# EAGLE schematic 19P_Connector (EAGLE 6.3)
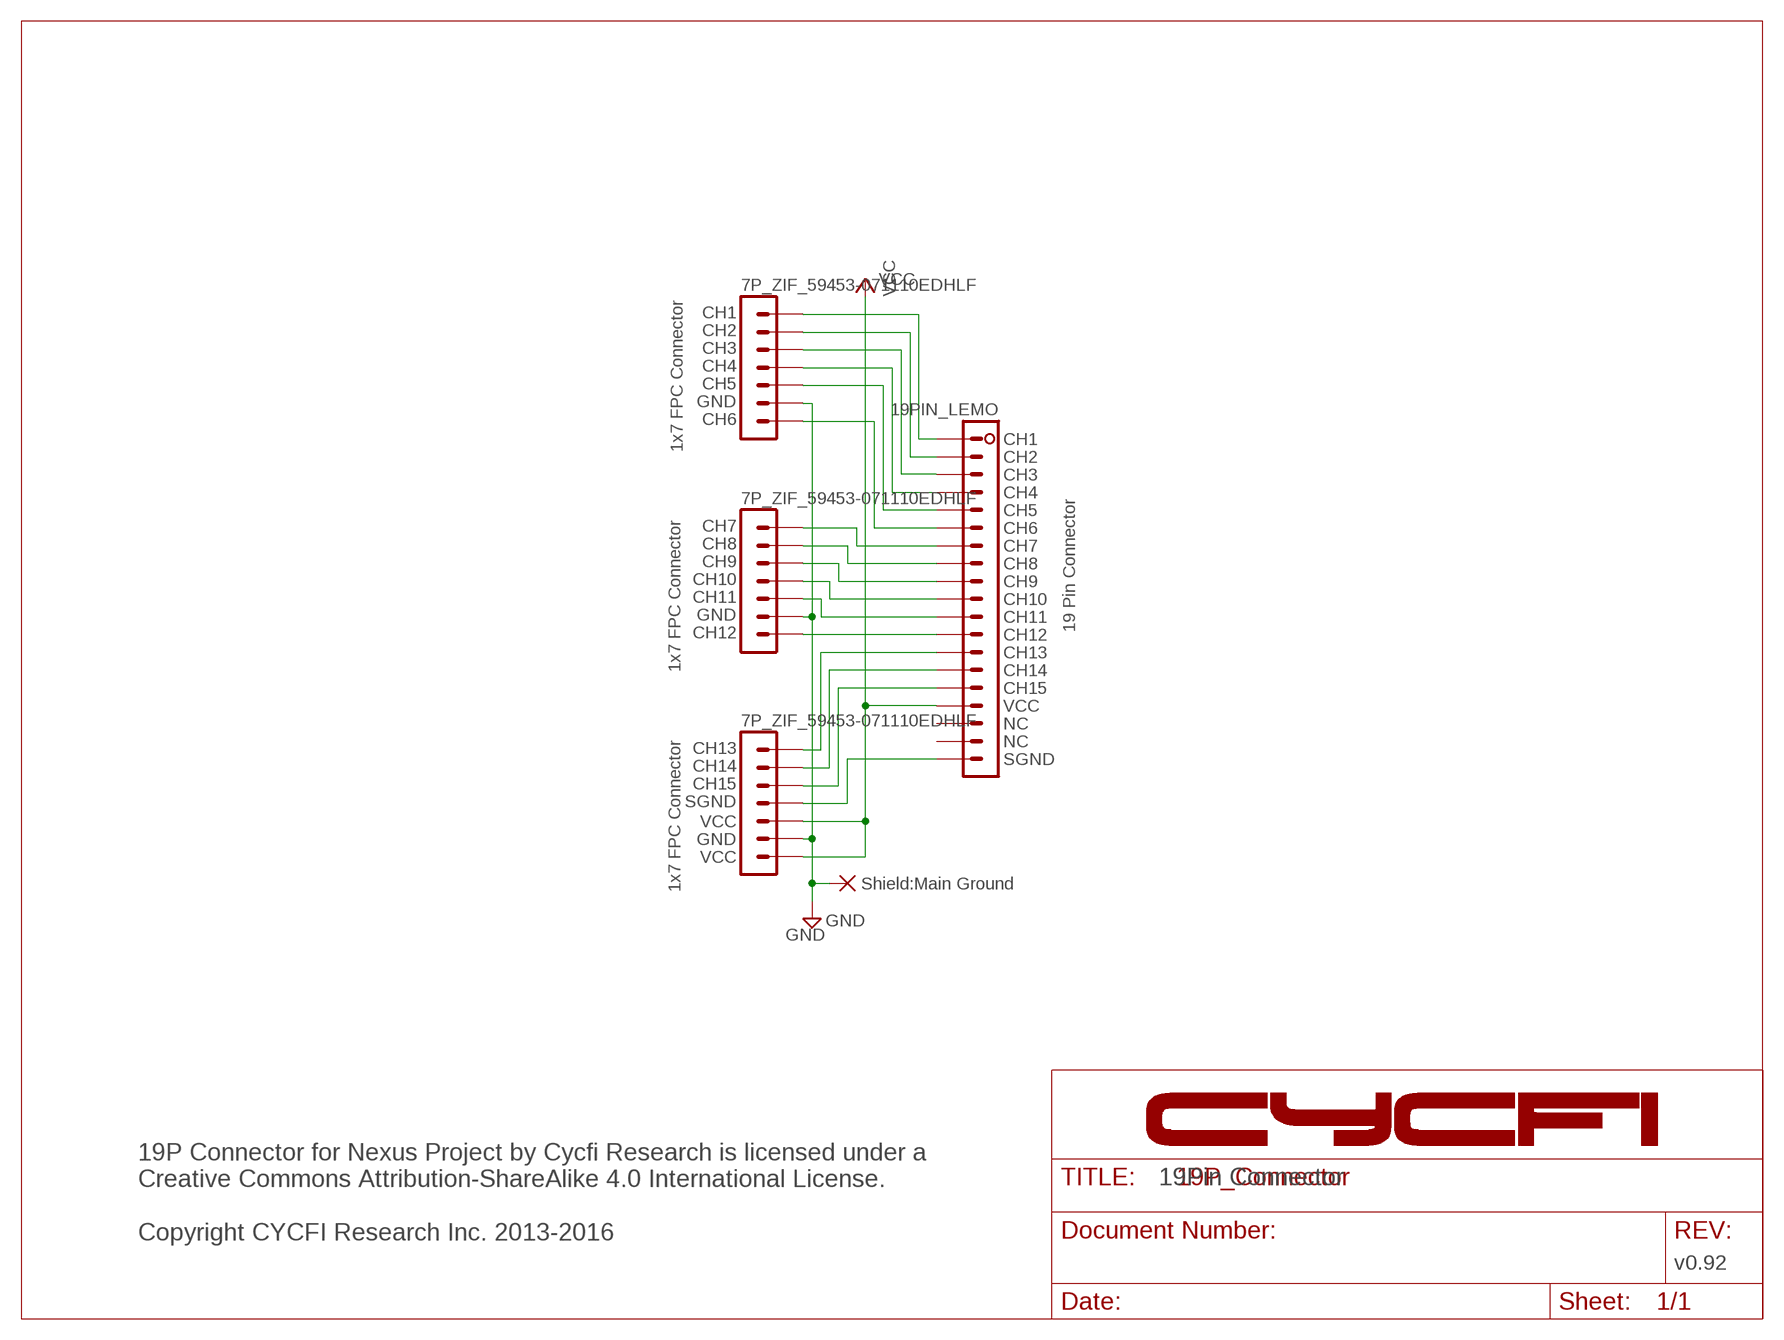
[diagram p0: schematic, sheet 1]

## Parts
C1  19PIN_LEMO  [19PIN_LEMO]
H1  7P_ZIF_59453-071110EDHLF  [7P_ZIF_59453-071110EDHLF]
H2  7P_ZIF_59453-071110EDHLF  [7P_ZIF_59453-071110EDHLF]
H3  7P_ZIF_59453-071110EDHLF  [7P_ZIF_59453-071110EDHLF]
PAD1  1,6/0,8  [1,6/0,8]

## Nets
CH1: C1.P$1 H1.P$1
CH2: C1.P$2 H1.P$2
CH3: C1.P$3 H1.P$3
CH4: C1.P$4 H1.P$4
CH5: C1.P$5 H1.P$5
CH6: C1.P$6 H1.P$7
CH7: C1.P$7 H2.P$1
CH8: C1.P$8 H2.P$2
CH9: C1.P$9 H2.P$3
CH10: C1.P$10 H2.P$4
CH11: C1.P$11 H2.P$5
CH12: C1.P$12 H2.P$7
CH13: C1.P$13 H3.P$1
CH14: C1.P$14 H3.P$2
CH15: C1.P$15 H3.P$3
GND: H1.P$6 H2.P$6 H3.P$6 PAD1.1(P)
N$1: C1.P$19 H3.P$4
VCC: C1.P$16 H3.P$5 H3.P$7
Unconnected: C1.P$17 C1.P$18

## Notes on the sheet
- VCC
- CH1
- CH2
- CH3
- CH4
- CH5
- GND
- CH6
- CH1
- 1x7 FPC Connector
- CH2
- CH3
- CH4 | 19 Pin Connector
- CH5
- CH7 | CH6
- CH8 | CH7
- CH9 | CH8
- CH10 | CH9
- CH11 | CH10
- GND | CH11
- CH12 | CH12
- CH13
- 1x7 FPC Connector | CH14
- CH15
- VCC
- NC
- NC
- CH13
- SGND
- CH14
- CH15
- SGND
- VCC
- GND
- VCC
- 1x7 FPC Connector | Shield:Main Ground
- GND
- 19Pin Connector
- 19P Connector for Nexus Project by Cycfi Research is licensed under a 
  Creative Commons Attribution-ShareAlike 4.0 International License. 
  
  Copyright CYCFI Research Inc. 2013-2016
- v0.92

## Library data of the parts
C1 = CYCFI_Con:19PIN_LEMO
H1-H3 = CYCFI_Con:7P_ZIF_59453-071110EDHLF
PAD1 = wirepad:1,6/0,8: THROUGH-HOLE PAD